# EAGLE schematic V03 (EAGLE 7.1.0)
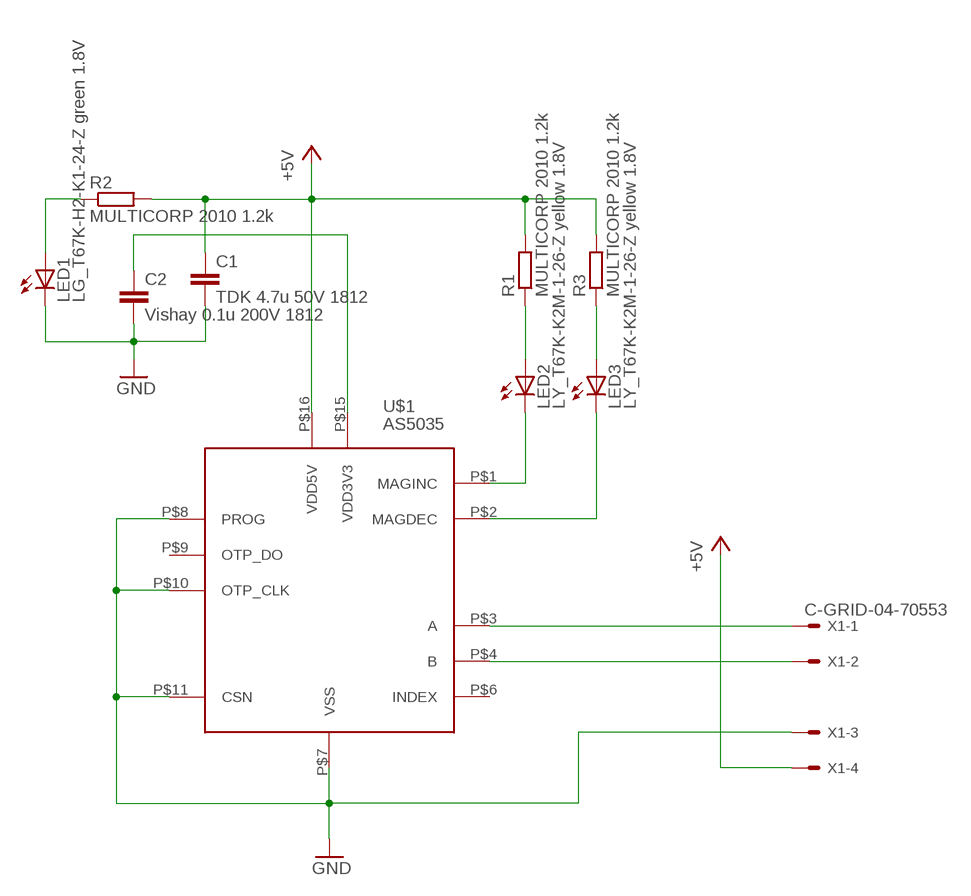
[diagram p0: schematic, sheet 1]

## Parts
C1  TDK 4.7u 50V 1812  C-EUC1812K  [C1812K]
C2  Vishay 0.1u 200V 1812  C-EUC1812K  [C1812K]
LED1  LG_T67K-H2-K1-24-Z green 1.8V  LG_T679-E1F1-1  [PLCC2]
LED2  LY_T67K-K2M-1-26-Z yellow 1.8V  LY_T679-D2E2-1  [PLCC2]
LED3  LY_T67K-K2M-1-26-Z yellow 1.8V  LY_T679-D2E2-1  [PLCC2]
R1  MULTICORP 2010 1.2k  R-EU_R2010  [R2010]
R2  MULTICORP 2010 1.2k  R-EU_R2010  [R2010]
R3  MULTICORP 2010 1.2k  R-EU_R2010  [R2010]
U$1  AS5035  [TSSOP-16]
X1  C-GRID-04-70553  [70553-04]

## Nets
+5V: C1.1 R1.2 R2.2 R3.2 U$1.P$16(VDD5V) X1.4
GND: C1.2 C2.2 LED1.C U$1.P$7(VSS) U$1.P$8(PROG) U$1.P$10(OTP_CLK) U$1.P$11(CSN) X1.3
N$1: C2.1 U$1.P$15(VDD3V3)
N$2: LED2.A R1.1
N$3: LED2.C U$1.P$1(MAGINC)
N$4: LED3.C U$1.P$2(MAGDEC)
N$5: LED3.A R3.1
N$6: LED1.A R2.1
N$7: U$1.P$4(B) X1.2
N$8: U$1.P$3(A) X1.1
Unconnected: U$1.P$6(INDEX) U$1.P$9(OTP_DO)

## Library data of the parts
C1 C2 = rcl:C-EU: CAPACITOR, European symbol
LED1 = led:*_T679-?-1: LC TOPLED® Low Current LED Source: http://catalog.osram-os.com .. LG_LS_LY_T679_OBS.pdf; COLOR: green
LED2 LED3 = led:*_T679-?-1: LC TOPLED® Low Current LED Source: http://catalog.osram-os.com .. LG_LS_LY_T679_OBS.pdf; COLOR: yellow
R1-R3 = rcl:R-EU_: RESISTOR, European symbol
U$1 = keysie:AS5035
X1 = con-molex:C-GRID-04: CONNECTOR wire to board 2.54 mm (0.100") pitch header; OC_FARNELL: unknown; OC_NEWARK: unknown